# EAGLE design OSSIICBNew (EAGLE 6.5.0)

## Sheet 1 of 2
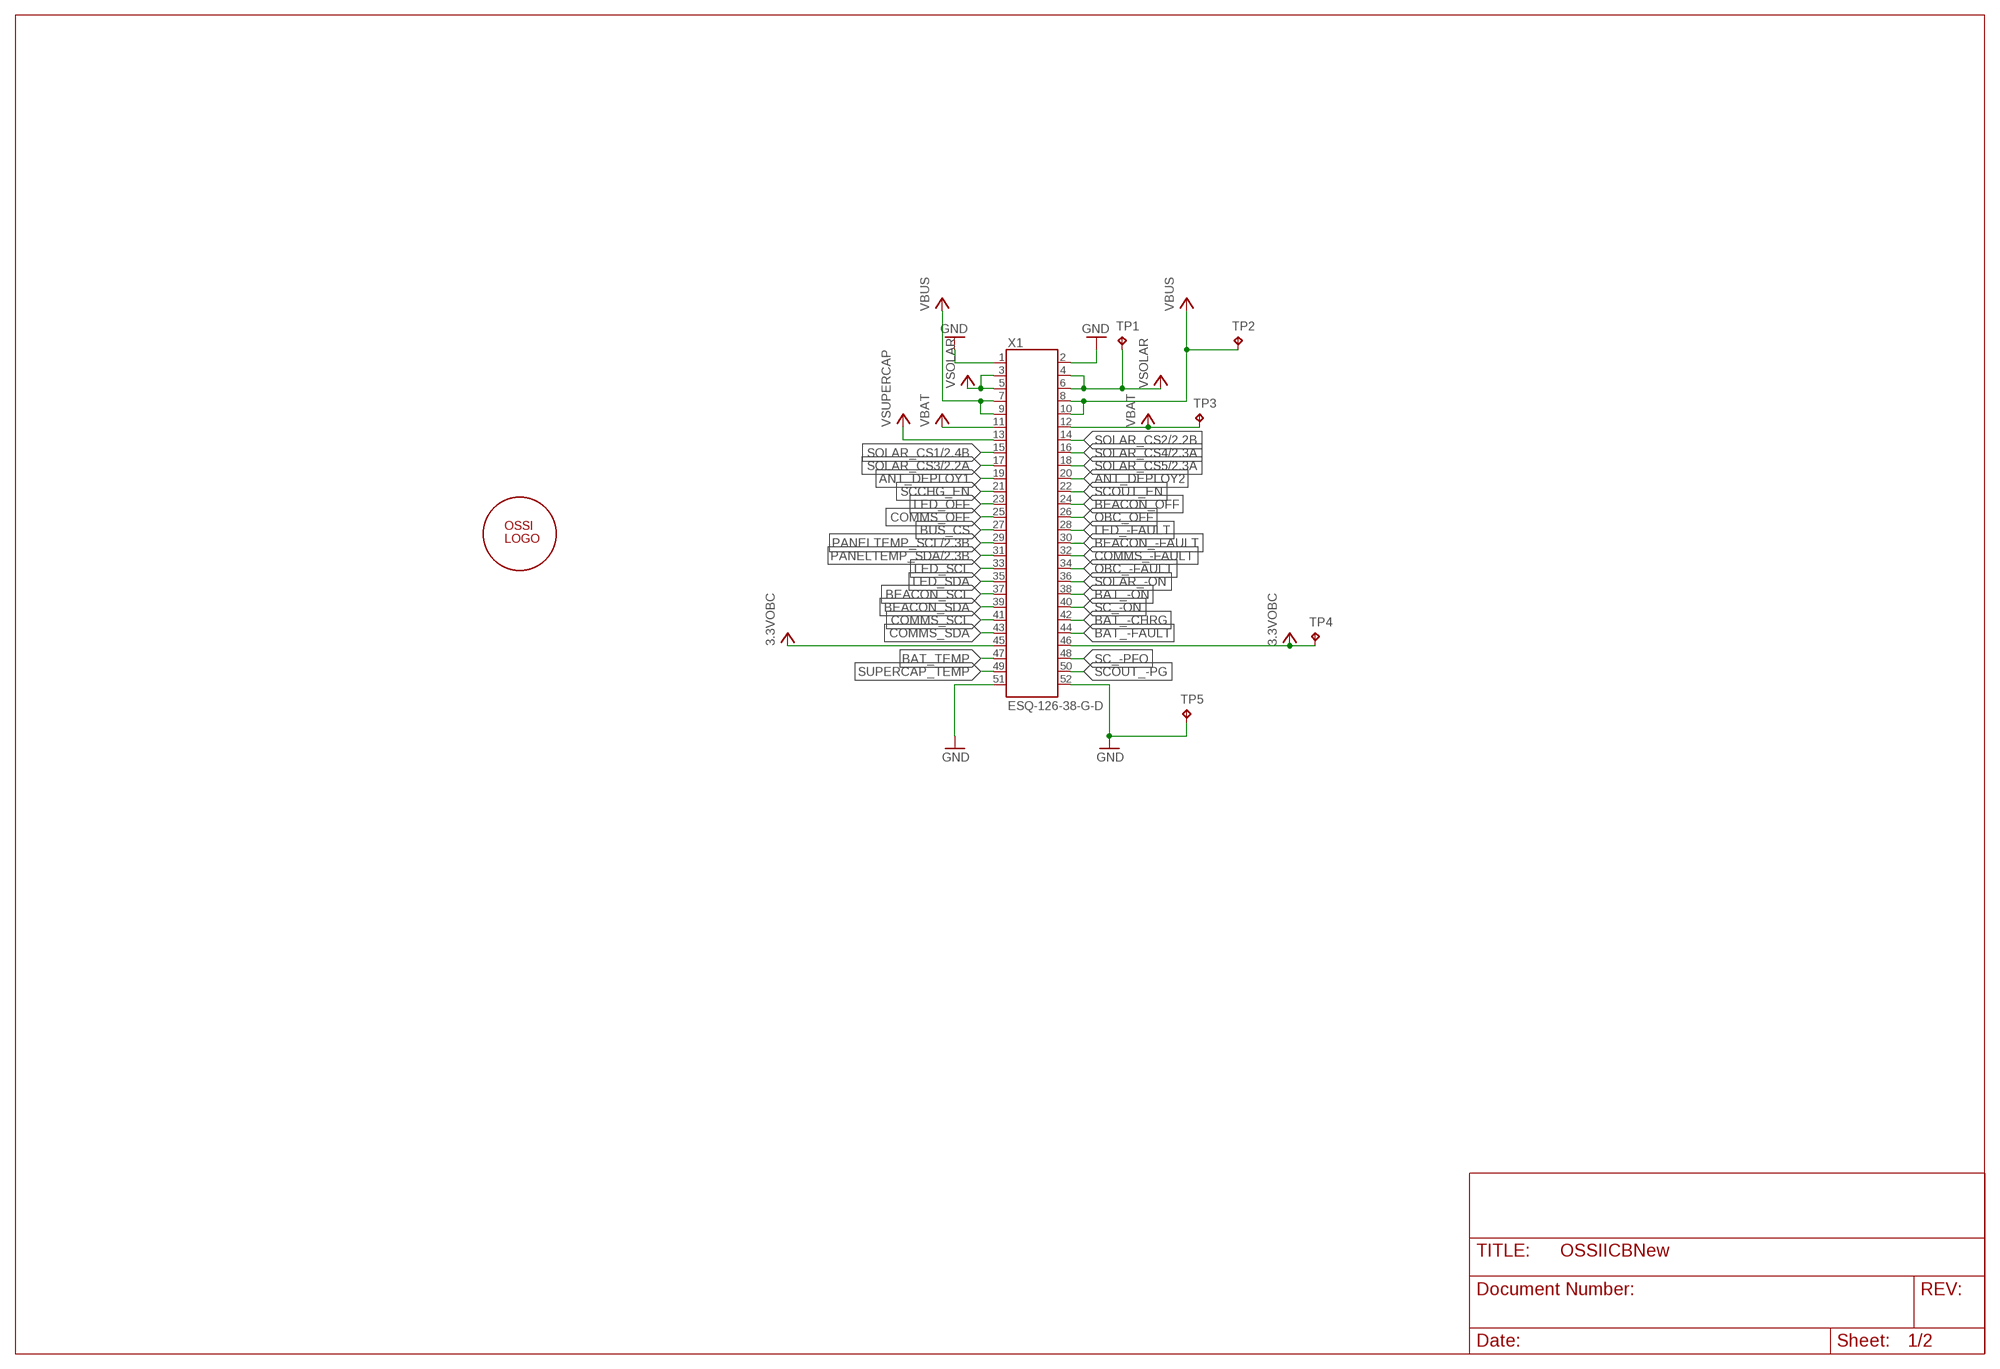
[diagram p0: schematic, sheet 1]

### Parts
TP1  TP  [TP-13]
TP2  TP  [TP-13]
TP3  TP  [TP-13]
TP4  TP  [TP-13]
TP5  TP  [TP-13]
U$1  OSSILOGO-10  [OSSILOGO1010]
X1  ESQ-126-38-G-D  [ESQ-126-XX-X-D]

### Nets
3.3VOBC: TP4.TP X1.45 X1.46 ; also sheet 2
ANT_DEPLOY1: X1.19
ANT_DEPLOY2: X1.20
BAT_-CHRG: X1.42
BAT_-FAULT: X1.44
BAT_-ON: X1.38
BAT_TEMP: X1.47
BEACON_-FAULT: X1.30
BEACON_OFF: X1.24
BEACON_SCL: X1.37
BEACON_SDA: X1.39
BUS_CS: X1.27
COMMS_-FAULT: X1.32
COMMS_OFF: X1.25
COMMS_SCL: X1.41
COMMS_SDA: X1.43
GND: TP5.TP X1.1 X1.2 X1.51 X1.52 ; also sheet 2
LED_-FAULT: X1.28
LED_OFF: X1.23
LED_SCL: X1.33
LED_SDA: X1.35
OBC_-FAULT: X1.34
OBC_OFF: X1.26
PANELTEMP_SCL: X1.29 ; also sheet 2
PANELTEMP_SDA: X1.31 ; also sheet 2
SC_-ON: X1.40
SC_-PFO: X1.48
SCCHG_EN: X1.21
SCOUT_-PG: X1.50
SCOUT_EN: X1.22
SOLAR_-ON: X1.36
SOLAR_CS1: X1.15 ; also sheet 2
SOLAR_CS2: X1.14 ; also sheet 2
SOLAR_CS3: X1.17 ; also sheet 2
SOLAR_CS4: X1.16 ; also sheet 2
SOLAR_CS5: X1.18 ; also sheet 2
SUPERCAP_TEMP: X1.49
VBAT: TP3.TP X1.11 X1.12
VBUS: TP2.TP X1.7 X1.8 X1.9 X1.10
VSOLAR: TP1.TP X1.3 X1.4 X1.5 X1.6 ; also sheet 2
VSUPERCAP: X1.13

## Sheet 2 of 2
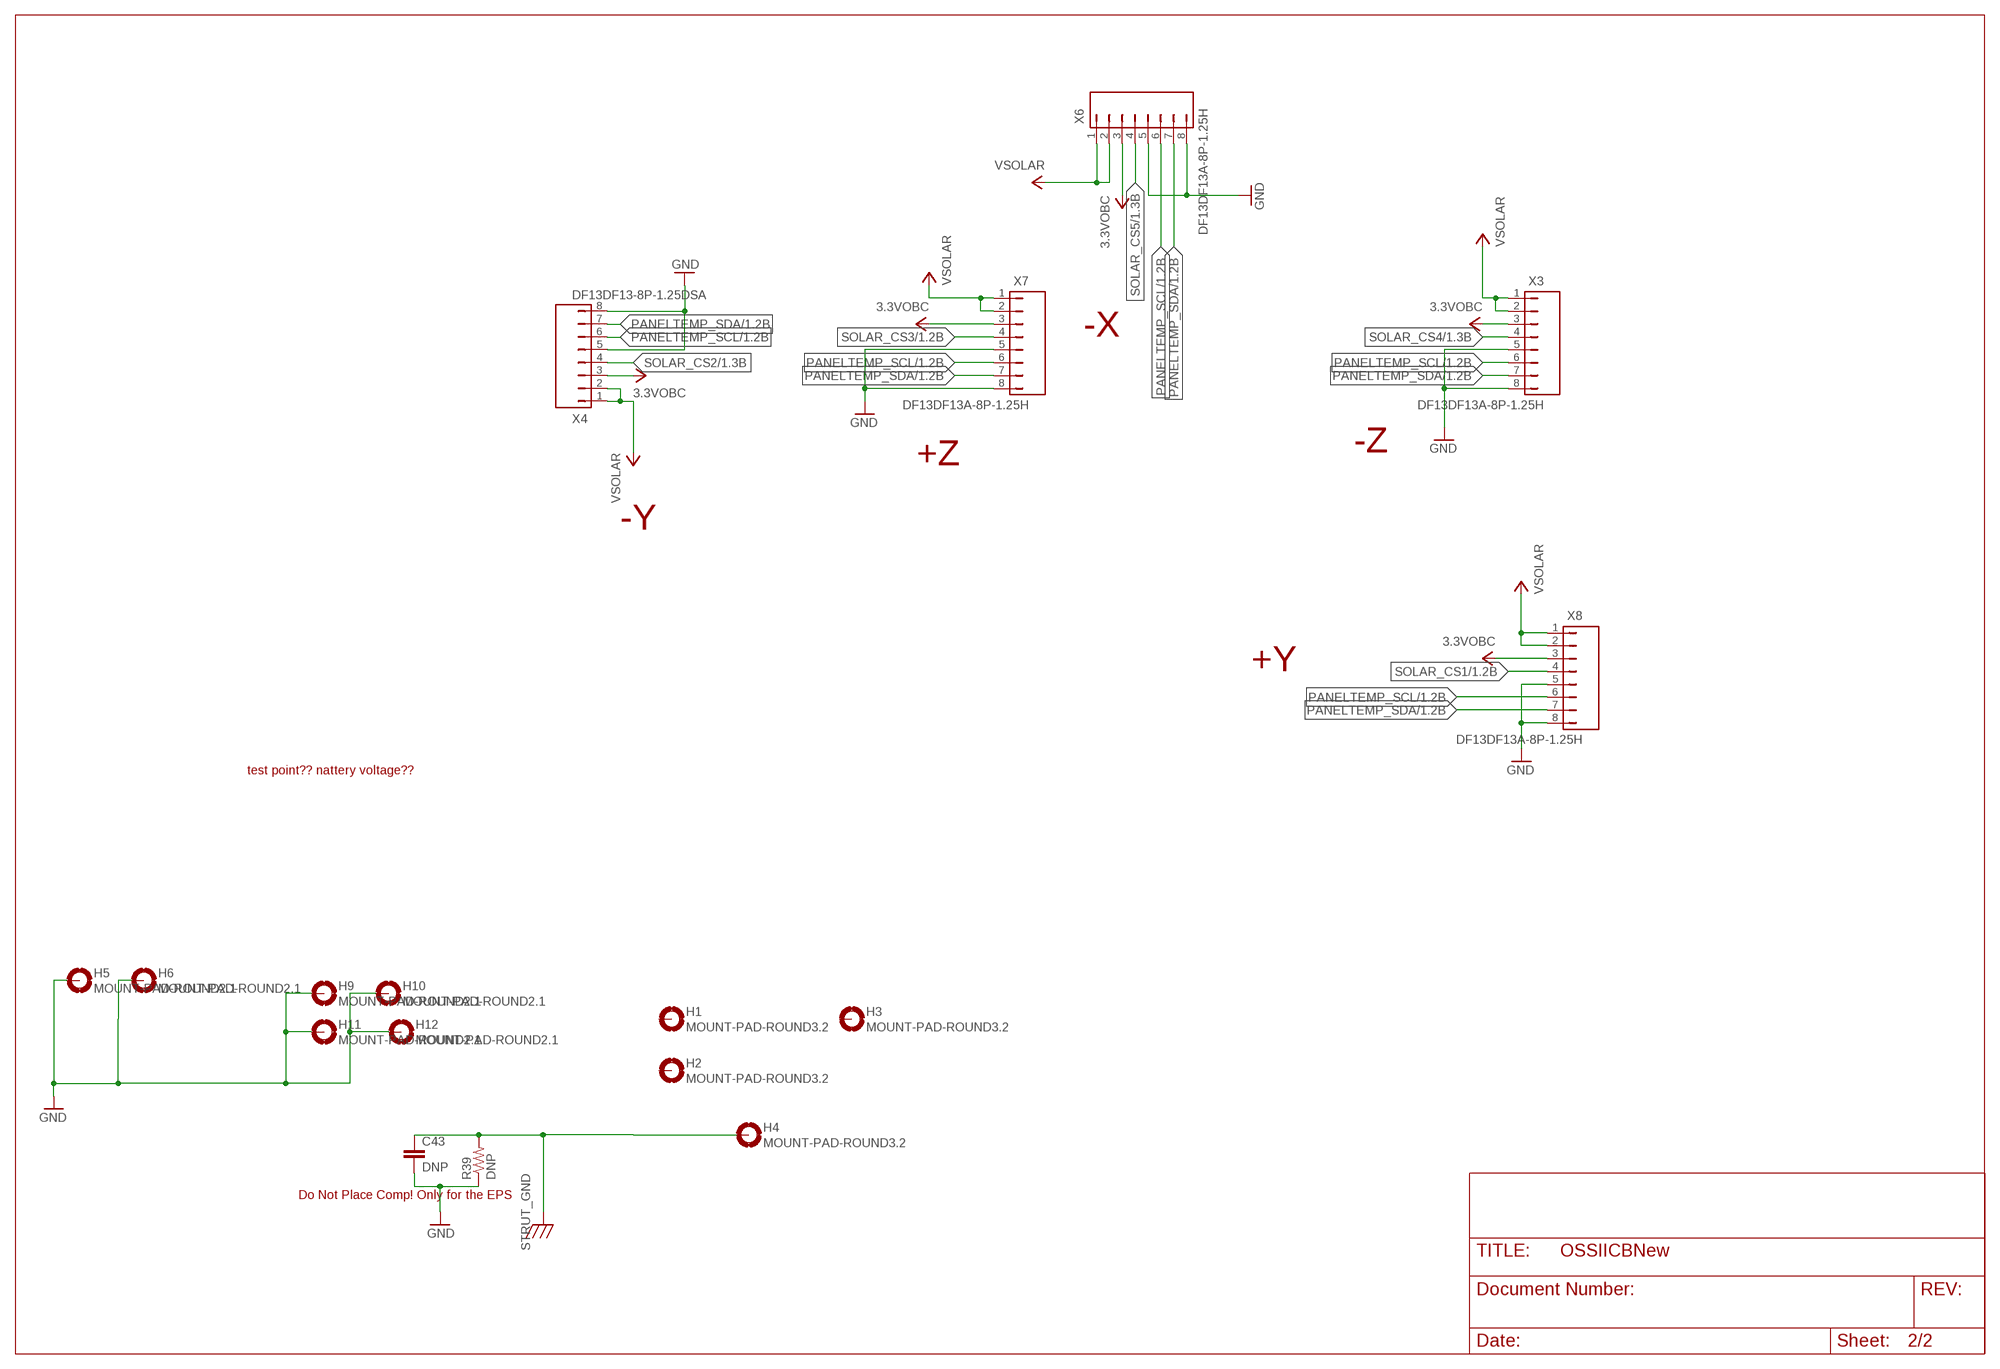
[diagram p1: schematic, sheet 2]

### Parts
C43  DNP  C0805(2012)  [C0805(2012)]
H1  MOUNT-PAD-ROUND3.2  [3.2-PAD-ROUND]
H2  MOUNT-PAD-ROUND3.2  [3.2-PAD-ROUND]
H3  MOUNT-PAD-ROUND3.2  [3.2-PAD-ROUND]
H4  MOUNT-PAD-ROUND3.2  [3.2-PAD-ROUND]
H5  MOUNT-PAD-ROUND2.1  [2.1-PAD-ROUND]
H6  MOUNT-PAD-ROUND2.1  [2.1-PAD-ROUND]
H9  MOUNT-PAD-ROUND2.1  [2.1-PAD-ROUND]
H10  MOUNT-PAD-ROUND2.1  [2.1-PAD-ROUND]
H11  MOUNT-PAD-ROUND2.1  [2.1-PAD-ROUND]
H12  MOUNT-PAD-ROUND2.1  [2.1-PAD-ROUND]
R39  DNP  RWSL1206  [WSL1206]
X3  DF13DF13A-8P-1.25H  [DF13A-8P]
X4  DF13DF13-8P-1.25DSA  [DF13-8P-1.25DSA]
X6  DF13DF13A-8P-1.25H  [DF13A-8P]
X7  DF13DF13A-8P-1.25H  [DF13A-8P]
X8  DF13DF13A-8P-1.25H  [DF13A-8P]

### Nets
3.3VOBC: X3.3 X4.3 X6.3 X7.3 X8.3 ; also sheet 1
GND: C43.2 H5.B3,2(MOUNT) H6.B3,2(MOUNT) H9.B3,2(MOUNT) H10.B3,2(MOUNT) H11.B3,2(MOUNT) H12.B3,2(MOUNT) R39.P$1 X3.5 X3.8 X4.5 X4.8 X6.5 X6.8 X7.5 X7.8 X8.5 X8.8 ; also sheet 1
PANELTEMP_SCL: X3.6 X4.6 X6.6 X7.6 X8.6 ; also sheet 1
PANELTEMP_SDA: X3.7 X4.7 X6.7 X7.7 X8.7 ; also sheet 1
SOLAR_CS1: X8.4 ; also sheet 1
SOLAR_CS2: X4.4 ; also sheet 1
SOLAR_CS3: X7.4 ; also sheet 1
SOLAR_CS4: X3.4 ; also sheet 1
SOLAR_CS5: X6.4 ; also sheet 1
STRUT_GND: C43.1 H4.B3,2(MOUNT) R39.P$2
VSOLAR: X3.1 X3.2 X4.1 X4.2 X6.1 X6.2 X7.1 X7.2 X8.1 X8.2 ; also sheet 1
Unconnected: H1.B3,2(MOUNT) H2.B3,2(MOUNT) H3.B3,2(MOUNT)

### Notes on the sheet
- -X
- -Z
- +Z
- -Y
- +Y
- test point?? nattery voltage??
- Do Not Place Comp! Only for the EPS

## Library data of the parts
C43 = OSSI:C
H1-H6 H9-H12 = OSSI:MOUNT-PAD-ROUND
R39 = OSSI:R
TP1-TP5 = OSSI:TP
U$1 = OSSI:OSSILOGO
X1 = OSSI:ESQ-126-: Samtec ESQ-126-XX-G-D Elevated Sockets Seires ESQ-126-37-G-D ESQ-126-38-G-D ESQ-126-39-G-D
X3 X4 X6-X8 = OSSI:DF13: Hirose DF13 series connector

## Board
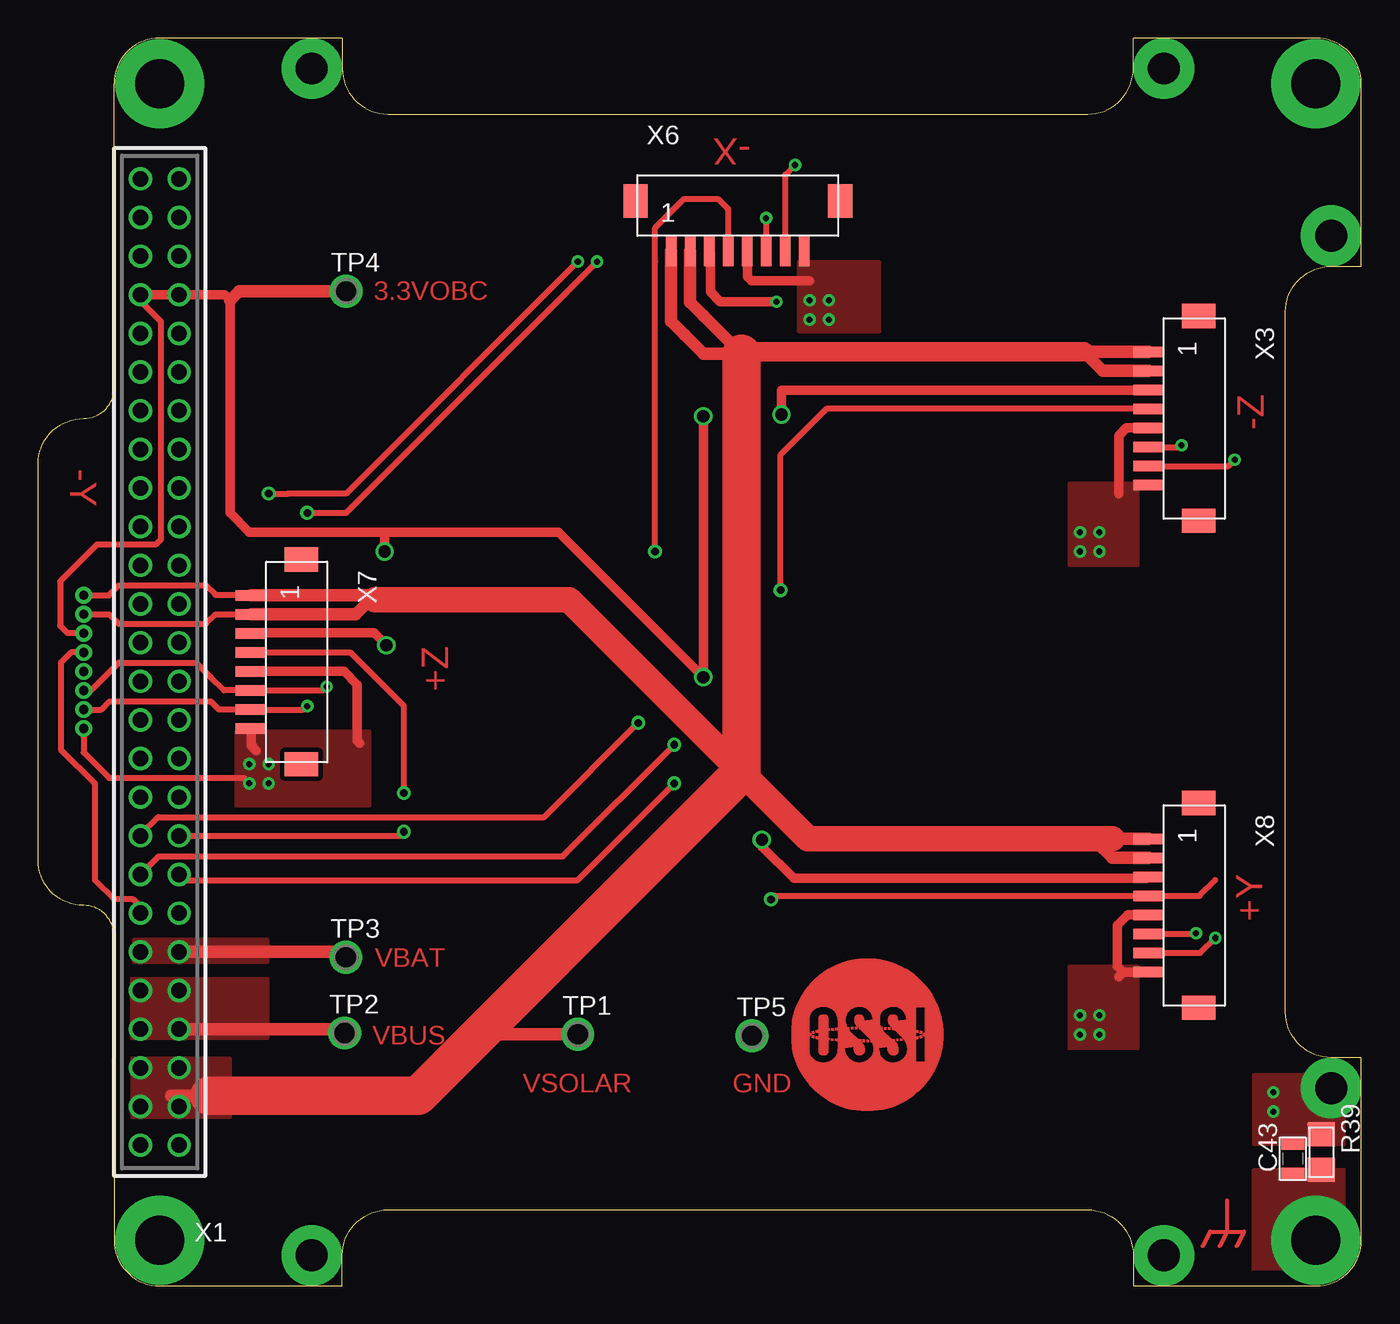
[diagram p2: board, top side]
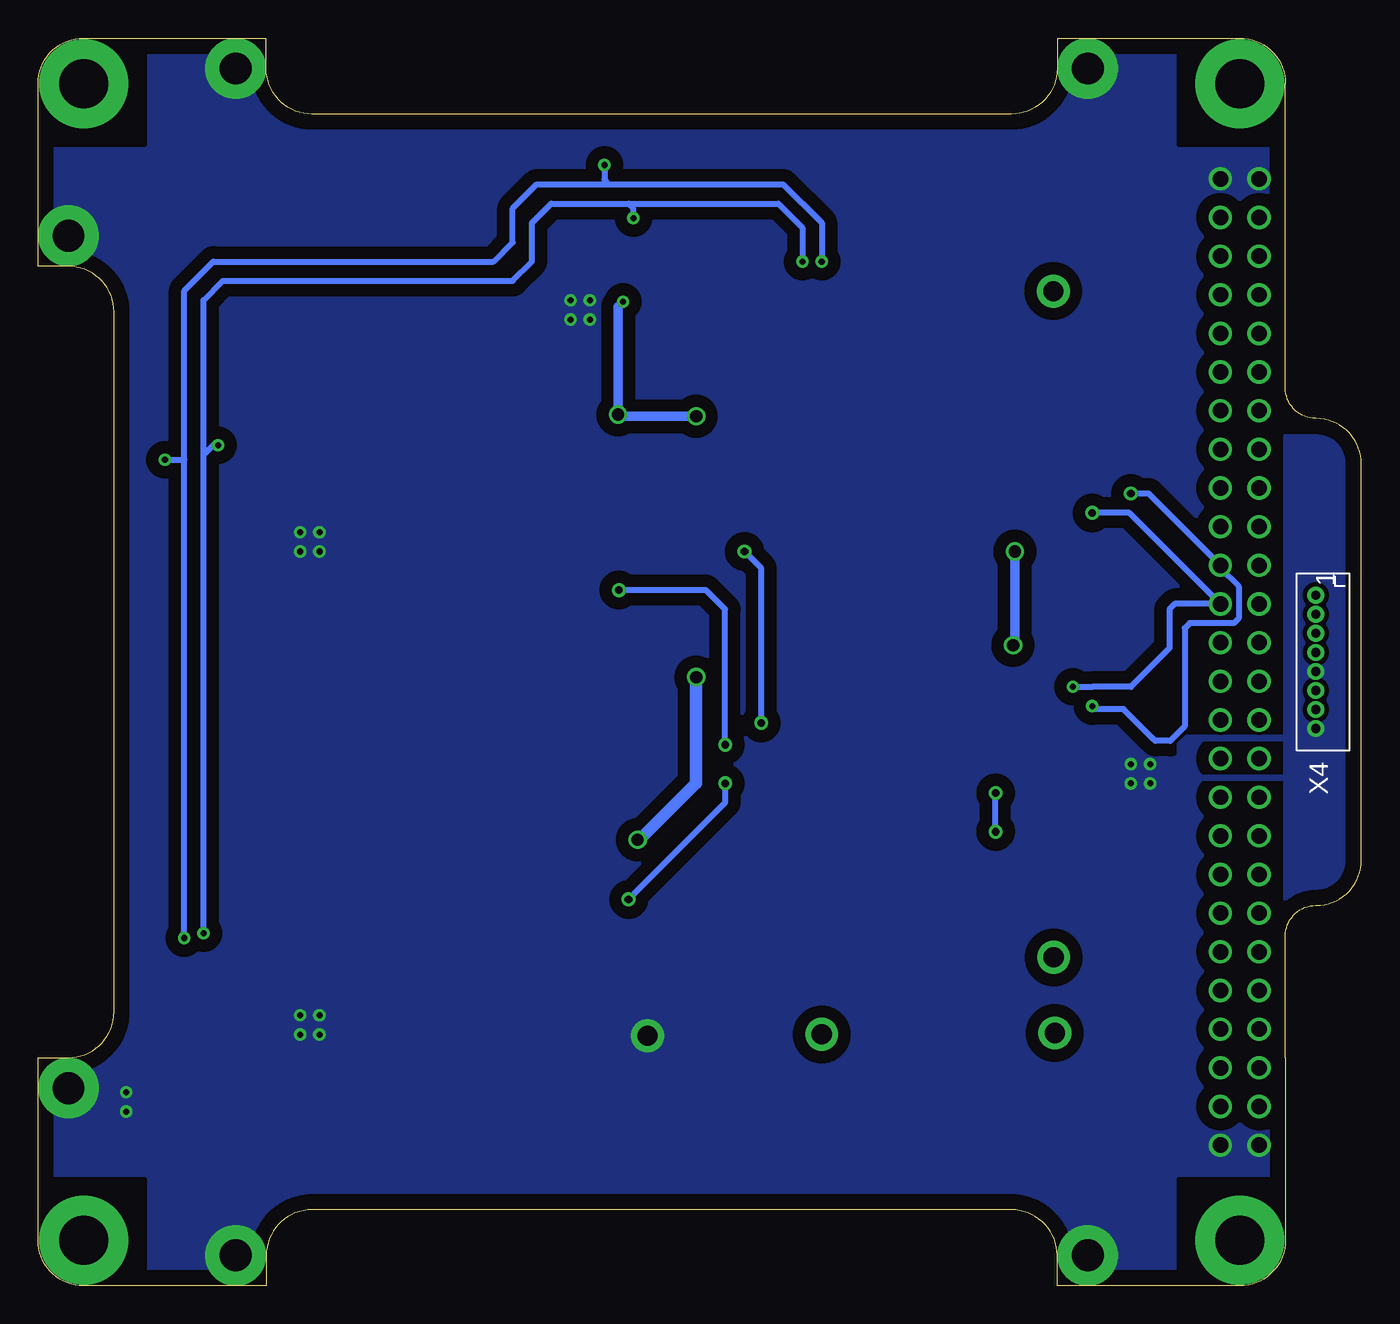
[diagram p3: board, bottom side, seen from below]

Size 87 x 82 mm. Coordinates in mm from the lower left corner, seen from the top.
Outline: 5,15 5,3 arc90 8,0 20,0 20,2 arc-90 23,5 69,5 arc-90 72,2 72,0 84,0 arc90 87,3 87,15 85,15 arc-90 82,18 82,64 arc-90 85,67 87,67 87,79 arc90 84,82 72,82 72,80 arc-90 69,77 23,77 arc-90 20,80 20,82 8,82 arc90 5,79 5,59 arc-90 3,57 arc90 0,54 0,28 arc90 3,25 arc-90 5,23 5,15
Copper layers (1*16): Top 0.035mm / dielectric 1.5mm / Bottom 0.035mm
Design rules "default": minimum track width 10mil, minimum drill 24mil, track to track 8mil, track to pad 8mil, pad to pad 8mil, via to via 8mil, smd to smd 8mil, copper to edge 40mil, drill to drill 8mil, minimum pad ring 10mil, minimum via ring 8mil, stop-mask expansion 4mil, vias tented up to drill 0mil, thermal gap 10mil

### Footprints (pad centres in the part's own frame; a part is rotated, then mirrored left to right if it is on the bottom)
C0805(2012) = smd 0.7 x 1.5: 1 -0.95,0; 2 0.95,0
3.2-PAD-ROUND = drill 3.2 pad 5.842: B3,2 0,0
2.1-PAD-ROUND = drill 2.1 pad 4: B3,2 0,0
WSL1206 = smd 1.57 x 1.78: P$1 -1.165,0; P$2 1.165,0
TP-13 = drill 1.321 pad 2.159: TP 0,0
ESQ-126-XX-X-D = drill 1.016 pad 1.524: 1 -1.27,31.75; 2 1.27,31.75; 3 -1.27,29.21; 4 1.27,29.21; 5 -1.27,26.67; 6 1.27,26.67; 7 -1.27,24.13; 8 1.27,24.13; 9 -1.27,21.59; 10 1.27,21.59; 11 -1.27,19.05; 12 1.27,19.05; 13 -1.27,16.51; 14 1.27,16.51; 15 -1.27,13.97; 16 1.27,13.97; 17 -1.27,11.43; 18 1.27,11.43; 19 -1.27,8.89; 20 1.27,8.89; 21 -1.27,6.35; 22 1.27,6.35; 23 -1.27,3.81; 24 1.27,3.81; 25 -1.27,1.27; 26 1.27,1.27; 27 -1.27,-1.27; 28 1.27,-1.27; 29 -1.27,-3.81; 30 1.27,-3.81; 31 -1.27,-6.35; 32 1.27,-6.35; 33 -1.27,-8.89; 34 1.27,-8.89; 35 -1.27,-11.43; 36 1.27,-11.43; 37 -1.27,-13.97; 38 1.27,-13.97; 39 -1.27,-16.51; 40 1.27,-16.51; 41 -1.27,-19.05; 42 1.27,-19.05; 43 -1.27,-21.59; 44 1.27,-21.59; 45 -1.27,-24.13; 46 1.27,-24.13; 47 -1.27,-26.67; 48 1.27,-26.67; 49 -1.27,-29.21; 50 1.27,-29.21; 51 -1.27,-31.75; 52 1.27,-31.75
DF13A-8P = smd 0.7 x 2: 1 -4.375,0; 2 -3.125,0; 3 -1.875,0; 4 -0.625,0; 5 0.625,0; 6 1.875,0; 7 3.125,0; 8 4.375,0 | smd 1.6 x 2.2: P$1 -6.725,3.3; P$2 6.725,3.3
DF13-8P-1.25DSA = drill 0.6: 1 4.375,0; 2 3.125,0; 3 1.875,0; 4 0.625,0; 5 -0.625,0; 6 -1.875,0; 7 -3.125,0; 8 -4.375,0

### Placement (x,y rotation side)
C43  82.48,8.35 90 top
H1  8,3 0 top
H2  8,79 0 top
H3  84,79 0 top
H4  84,3 0 top
H5  74,2 0 top
H6  18,2 0 top
H9  18,80 0 top
H10  85,69 0 top
H11  74,80 0 top
H12  85,13 0 top
R39  84.37,8.79 270 top
TP1  35.48,16.53 0 top
TP2  20.16,16.61 0 top
TP3  20.24,21.59 0 top
TP4  20.26,65.37 0 top
TP5  46.94,16.44 0 top
U$1  54.53,16.51 0 top
X1  8,41 180 top
X3  73,57 270 top
X4  3,41 90 bottom
X6  46,68 0 top
X7  14,41 270 top
X8  73,25 270 top

### Tracks (layer width: path | path; a pad name or v marks a point on that pad's centre or on a via)
3.3VOBC  (via drill 0.4, 0.8)
  Top 0.406: X1.46 6.73,64.72 8.06,63.39 8.06,49.03 7.74,48.71 3.87,48.71 1.94,46.77 | 1.94,46.77 | 1.94,46.77 1.45,46.29 1.45,43.39 1.94,42.9 2.97,42.9 X4.3
  Top 0.61: 22.78,49.53 13.89,49.53 12.62,50.8 12.62,64.77 12.26,65.13 X1.45 X1.46 | 22.78,49.53 34.21,49.53 v43.73,40.01 43.73,43.18 v43.73,57.15 | X3.3 68.23,58.87 48.87,58.87 v48.87,57.26 | X8.3 72.9,26.77 49.68,26.77 47.58,28.87 v47.58,29.31 | X6.3 44.19,67.93 44.19,65.32 44.84,64.68 v48.55,64.68 | X7.3 14.03,42.9 22.1,42.9 v22.9,42.1 | v22.78,48.26 22.78,49.53
  Top 0.813: TP4.TP 13.22,65.37 12.62,64.77
  Bottom 0.61: v48.55,64.68 48.87,64.36 v48.87,57.26 48.76,57.15 v43.73,57.15 | v22.9,42.1 22.78,42.22 v22.78,48.26
  Bottom 0.813: v43.73,40.01 43.73,33.02 47.55,29.21 47.58,29.25 v47.58,29.31
GND  (via drill 0.4)
  Top 0.406: X4.8 3,35.06 4.68,33.39 13.52,33.39 v13.89,33.02
  Top 0.61: X7.5 20.11,40.38 20.97,39.52 20.97,35.81 21.13,35.65 | X7.8 14,35.52 14.36,35.16 | X8.8 71.34,20.62 | 71.34,20.62 71.04,20.32 | X8.5 71.63,24.38 70.97,23.71 70.97,21 71.34,20.62 | X3.5 71.53,56.38 71.04,55.88 71.04,52.07 | X6.5 46.62,66.33 46.91,66.04 50.72,66.04
  other vias: 50.72,63.5 50.72,64.77 51.99,63.5 51.99,64.77 68.5,48.26 69.77,48.26 69.77,49.53 68.5,49.53 68.5,17.78 68.5,16.51 69.77,16.51 69.77,17.78 15.16,33.02 13.89,34.29 15.16,34.29 81.2,12.72 81.2,11.45
  pour Bottom (isolate 0.813, no thermals): 5,82 87,82 87,0 5,0
  pour Bottom (isolate 0.305, no thermals): 1.19,55.88 1.19,25.4 5,25.4 5,55.88
  pour Top (no thermals): 50,67.26 50,62.74 55.32,62.74 55.32,62.9 55.32,67.26
  pour Top (no thermals): 67.79,47.38 72.31,47.38 72.31,52.71 72.15,52.71 67.79,52.71
  pour Top (no thermals): 67.79,15.63 72.31,15.63 72.31,20.96 72.15,20.96 67.79,20.96
  pour Top (no thermals): 86.98,9.33 86.98,13.85 79.93,13.85 79.93,9.33
  pour Top (isolate 0.305, no thermals): 13.02,31.58 21.79,31.58 21.79,36.42 13.02,36.42
  pour Bottom (no thermals): 4.52,33.23 13.99,33.23 13.99,33.55 4.52,33.55
  pour Bottom (no thermals): 4.07,35.81 11.13,35.81 11.13,33.23 15.16,33.23 15.16,34.29 12.1,34.29 12.12,36.17 4.07,36.17
N$2
  cutout Bottom: 5,82 5,75 12,75 12,82
  cutout Bottom: 80,82 80,75 87,75 87,82
  cutout Bottom: 80,7 80,0 87,0 87,7
  cutout Bottom: 5,7 5,0 12,0 12,7
N$58
  Top 0.254: 78.15,5.63 78.15,3.72
N$59
  Top 0.254: 78.15,3.56 77.04,3.56 76.57,2.61 | 78.15,3.56 79.27,3.56 78.79,2.61 | 78.15,3.56 77.68,2.61
PANELTEMP_SCL  (via drill 0.4, 0.5)
  Top 0.406: X4.6 3.49,39.12 5,40.64 5.32,40.96 10.4,40.96 11.35,40.01 12.23,39.12 X7.6 18.73,39.12 v18.97,39.37 | X8.6 76.07,23.12 v76.12,23.18 | X3.6 75.05,55.12 v75.17,55.24 | X6.6 47.88,70.16 v47.86,70.17 | v36.75,67.31 21.51,52.07 20.24,50.8 v17.7,50.8
  Bottom 0.406: v76.12,23.18 76.12,54.61 | 76.12,54.61 76.12,64.77 74.85,66.04 55.8,66.04 54.53,67.31 54.53,69.85 53.26,71.12 48.18,71.12 | 48.18,71.12 38.34,71.12 36.75,69.53 v36.75,67.31 | v75.17,55.24 75.48,55.24 76.12,54.61 | v47.86,70.17 47.86,70.8 48.18,71.12 | X1.29 15.26,50.8 v17.7,50.8 | X1.29 9.17,44.81 | X1.29 12.26,44.81 12.62,44.45 12.62,41.91 15.16,39.37 17.7,39.37 v18.97,39.37
PANELTEMP_SDA  (via drill 0.4, 0.5)
  Top 0.406: X4.7 4.14,37.88 4.68,38.42 11.35,38.42 11.67,38.1 11.89,37.88 X7.7 17.44,37.88 v17.7,38.1 | X8.7 76.41,21.88 v77.39,22.86 | X3.7 78.24,53.88 v78.66,54.29 | X6.7 49.12,73.02 v49.77,73.66 | v35.48,67.31 20.24,52.07 16.43,52.07 v15.16,52.07
  Bottom 0.406: v77.39,22.86 77.39,54.29 | 77.39,54.29 77.39,65.41 75.48,67.31 57.07,67.31 55.8,68.58 55.8,70.8 54.21,72.39 49.45,72.39 | 49.45,72.39 38.02,72.39 35.48,69.85 v35.48,67.31 | v78.66,54.29 77.39,54.29 | v49.77,73.66 49.77,72.71 49.45,72.39 | v15.16,52.07 13.99,52.07 X1.31 9.27,47.17 8.06,45.97 8.06,43.87 8.39,43.55 11.29,43.55 11.61,43.23 11.61,36.77 12.58,35.81 13.55,35.81 13.71,35.97 15.64,37.9 17.42,37.9 17.55,37.94 v17.7,38.1
SOLAR_CS1  (via drill 0.5)
  Top 0.406: 77.39,26.67 76.34,25.62 X8.4 73.02,25.64 73.06,25.64 48.42,25.64 v48.18,25.4 | X1.15 9.63,26.67 35.48,26.67 38.02,29.21 v41.83,33.02
  Bottom 0.406: v41.83,33.02 41.83,31.75 v48.18,25.4
SOLAR_CS2
  Top 0.406: X4.4 2.17,41.62 1.51,40.96 1.51,35.24 3.73,33.02 3.73,26.67 5,25.4 6.27,25.4 6.73,24.94 X1.14
SOLAR_CS3  (via drill 0.5)
  Top 0.406: X7.4 20.52,41.62 24.05,38.1 v24.05,32.38 | X1.17 23.77,29.57 v24.05,29.84
  Bottom 0.406: v24.05,29.84 v24.05,32.38
SOLAR_CS4  (via drill 0.5)
  Top 0.406: X1.16 7.93,28.23 8.87,28.23 32.42,28.23 34.5,28.23 v41.83,35.56 | v48.81,45.72 48.81,54.61 51.67,57.47 51.83,57.62 X3.4
  Bottom 0.406: v41.83,35.56 41.83,44.45 43.1,45.72 v48.81,45.72
SOLAR_CS5  (via drill 0.5)
  Top 0.406: X6.4 45.38,70.11 45.38,70.75 45.32,70.8 44.69,71.44 42.47,71.44 40.56,69.53 40.56,67.31 v40.56,48.26 | X1.18 6.73,29.63 7.9,30.81 33.27,30.81 v39.45,37
  Bottom 0.406: v39.45,37 39.45,47.16 v40.56,48.26
STRUT_GND
  pour Top (no thermals): 87.07,7.62 87.07,0 79.93,0 79.93,7.62
VBAT
  Top 0.813: X1.11 19.88,21.95 TP3.TP
  pour Top (no thermals): 6.29,22.74 6.29,21.29 15.08,21.29 15.08,22.74
VBUS
  Top 0.813: X1.7 19.88,16.87 20.24,16.51 20.24,16.54 TP2.TP
  pour Top (no thermals): 5.97,20.16 5.97,16.29 15.08,16.29 15.08,20.16
VSOLAR
  Top 0.305: 70,28.75 70,29.38
  Top 0.406: X4.1 4.66,45.38 5.32,46.04 11.03,46.04 11.67,45.4 13.89,45.4 13.97,45.4 X7.1 | X4.2 4.69,44.12 5.32,43.5 11.03,43.5 11.67,44.13 13.99,44.13 X7.2
  Top 0.813: 11.25,12.5 8.75,12.5 | X6.1 41.62,63.38 42.5,62.5 43.75,61.25 46.25,61.25 | X6.2 42.88,64.62 43.75,63.75 46.25,61.25 | X3.1 68.75,61.38 70,60.12 X3.2 | 46.38,61.38 46.25,61.25 | X8.1 70.62,29.38 | X8.2 70.62,28.12 70,28.75 | X7.1 21.86,45.38 21.99,45.24 | 21.99,45.24 22.14,45.09 | X7.2 20.87,44.12 21.99,45.24 | TP1.TP 29.03,16.53 28.43,15.94
  Top 1.27: 68.75,61.38 46.38,61.38 46.25,61.25
  Top 1.676: 70.62,29.38 70,29.38 50.62,29.38 46.25,33.75 34.91,45.09 22.14,45.09
  Top 2.54: 46.25,61.25 46.25,33.75 28.43,15.94 26.83,14.33 25,12.5 11.25,12.5
  pour Top (no thermals): 5.95,14.92 5.95,11.11 12.62,11.11 12.62,14.92

### Text on the board
Top: -X | 3.3VOBC | -Z | -Y | +Z | +Y | VBAT | VBUS | VSOLAR | GND